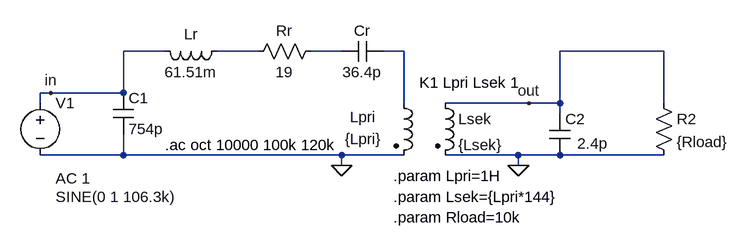
[diagram p0: schematic PiezoTransfo.asc]
PiezoTransfo.asc, the LTspice schematic file:
Version 4
SHEET 1 1000 680
WIRE -304 272 -304 256
WIRE -288 256 -304 256
WIRE -176 256 -288 256
WIRE -176 256 -176 192
WIRE -176 352 -304 352
WIRE -176 352 -176 320
WIRE -112 192 -176 192
WIRE 32 192 -32 192
WIRE 160 192 112 192
WIRE 160 352 -176 352
WIRE 160 368 160 352
WIRE 256 192 224 192
WIRE 256 272 256 192
WIRE 256 352 160 352
WIRE 432 352 320 352
WIRE 432 368 432 352
WIRE 448 272 320 272
WIRE 496 272 448 272
WIRE 496 272 496 192
WIRE 496 288 496 272
WIRE 496 352 432 352
WIRE 656 192 496 192
WIRE 656 272 656 192
WIRE 656 352 496 352
FLAG 160 368 0
FLAG 432 368 0
FLAG -288 256 in
FLAG 448 272 out
SYMBOL cap -192 256 R0
SYMATTR InstName C1
SYMATTR Value 754p
SYMBOL cap 224 176 R90
WINDOW 0 0 32 VBottom 0
WINDOW 3 32 32 VTop 0
SYMATTR InstName Cr
SYMATTR Value 36.4p
SYMBOL cap 480 288 R0
WINDOW 3 43 46 Left 0
SYMATTR InstName C2
SYMATTR Value 2.4p
SYMBOL res 128 176 R90
WINDOW 0 0 56 VBottom 0
WINDOW 3 32 56 VTop 0
SYMATTR InstName Rr
SYMATTR Value 19
SYMBOL ind -16 176 R90
WINDOW 0 5 56 VBottom 0
WINDOW 3 32 56 VTop 0
SYMATTR InstName Lr
SYMATTR Value 61.51m
SYMBOL ind2 240 256 R0
WINDOW 0 -67 37 Left 0
WINDOW 3 -75 71 Left 0
SYMATTR InstName Lpri
SYMATTR Value {Lpri}
SYMATTR Type ind
SYMBOL ind2 304 256 R0
SYMATTR InstName Lsek
SYMATTR Value {Lsek}
SYMATTR Type ind
SYMBOL voltage -304 256 R0
WINDOW 3 24 160 Left 0
WINDOW 123 24 132 Left 0
WINDOW 39 0 0 Left 0
SYMATTR Value SINE(0 1 106.3k)
SYMATTR Value2 AC 1
SYMATTR InstName V1
SYMBOL res 640 256 R0
SYMATTR InstName R2
SYMATTR Value {Rload}
TEXT 280 240 Left 0 !K1 Lpri Lsek 1
TEXT -112 336 Left 0 !.ac oct 10000 100k 120k
TEXT 240 416 Left 0 !.param Lsek={Lpri*144}
TEXT 240 384 Left 0 !.param Lpri=1H
TEXT 240 448 Left 0 !.param Rload=10k

The netlist it stands for:
* PiezoTransfo.asc
C1 in 0 754p
Cr N003 N002 36.4p
C2 out 0 2.4p
Rr N002 N001 19
Lr N001 in 61.51m
Lpri N003 0 {Lpri}
Lsek out 0 {Lsek}
V1 in 0 SINE(0 1 106.3k) AC 1
R2 out 0 {Rload}
K1 Lpri Lsek 1
.ac oct 10000 100k 120k
.param Lsek={Lpri*144}
.param Lpri=1H
.param Rload=10k
.backanno
.end